# Altium project Mother_Board_SSL2018.PrjPcb
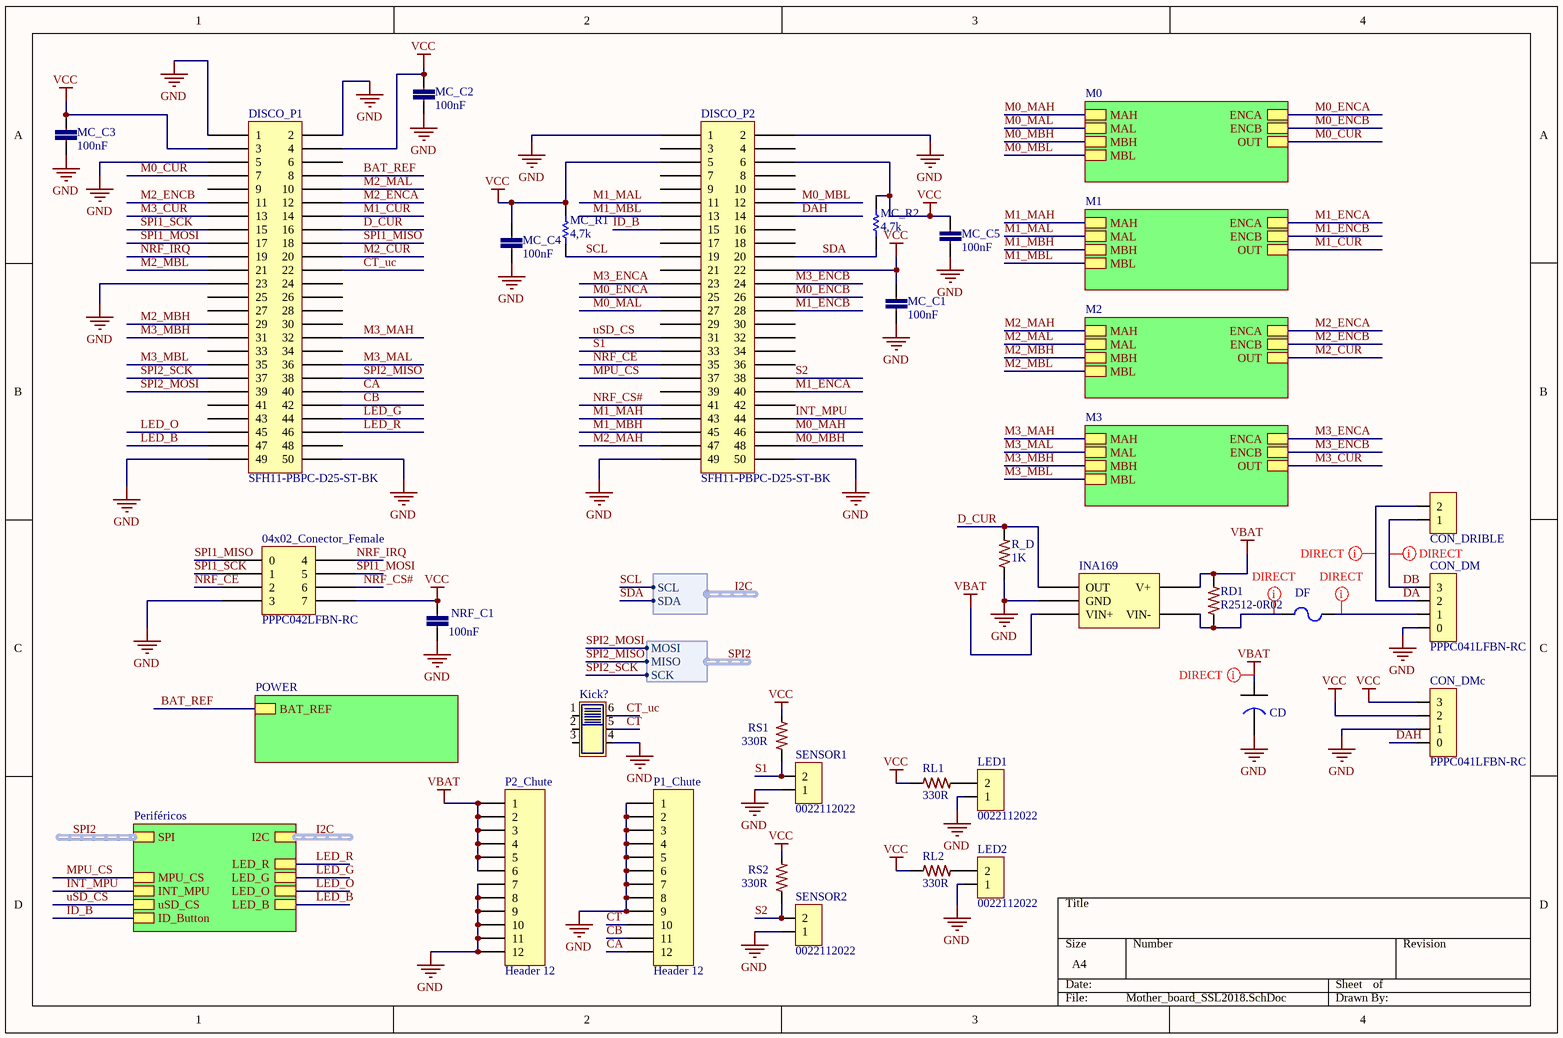
[diagram p0: Mother_board_SSL2018.SchDoc]
2 sheets, 57 parts. Net scope: hierarchical (ports join the sheet entries above them; power ports are global).
Board file: Mother_board_SSL2018.PcbDoc
Sheets:
  Mother_board_SSL2018.SchDoc
    Periféricos = Periféricos.SchDoc

## Sheet Mother_board_SSL2018.SchDoc
size A4

### Parts
04x02_Conector_Female  PPPC042LFBN-RC  [04x02_Conector_Female]
CD  EEE-FK1C681GP  [EEE-FK1C681GP]  (value not drawn)
CON_DM  PPPC041LFBN-RC  [04x01_Conector_Female - duplicate]
CON_DMc  PPPC041LFBN-RC  [04x01_Conector_Female - duplicate]
CON_DRIBLE  0022112022  [02x01_Conector_Male]  (value not drawn)
DF  MF-MSMF250/16X  [RESC4632X16N]  (value not drawn)
DISCO_P1  SFH11-PBPC-D25-ST-BK  [25x02_Conector_Female]
DISCO_P2  SFH11-PBPC-D25-ST-BK  [25x02_Conector_Female]
INA169  INA169NA  [SOT95P280X125-5N]  (value not drawn)
Kick?  JS202011SCQN  [SOP250P750X350-6N]  (value not drawn)
LED1  0022112022  [02x01_Conector_Male]
LED2  0022112022  [02x01_Conector_Male]
MC_C1  100nF  [0402-CAP]
MC_C2  100nF  [0402-CAP]
MC_C3  100nF  [0402-CAP]
MC_C4  100nF  [0402-CAP]
MC_C5  100nF  [0402-CAP]
MC_R1  4,7k  [0402]
MC_R2  4,7k  [0402]
NRF_C1  100nF  [0402-CAP]
P1_Chute  Header 12  [HDR1X12]
P2_Chute  Header 12  [HDR1X12]
R_D  1K  [0402-RES-HD]
RD1  R2512-0R02  [2512-RES-HD]
RL1  330R  [0402-RES-HD]
RL2  330R  [0402-RES-HD]
RS1  330R  [0402-RES-HD]
RS2  330R  [0402-RES-HD]
SENSOR1  0022112022  [02x01_Conector_Male]
SENSOR2  0022112022  [02x01_Conector_Male]

### Sub-sheets
M0 = MOTORES.SchDoc (file not in this document): MBH, MAH, MBL, MAL, ENCA, ENCB, OUT
M1 = MOTORES.SchDoc (file not in this document): MBH, MAH, MBL, MAL, ENCA, ENCB, OUT
M2 = MOTORES.SchDoc (file not in this document): MBH, MAH, MBL, MAL, ENCA, ENCB, OUT
M3 = MOTORES.SchDoc (file not in this document): MBH, MAH, MBL, MAL, ENCA, ENCB, OUT
Periféricos = Periféricos.SchDoc: MPU_CS, INT_MPU, uSD_CS, LED_R, LED_G, LED_O, LED_B, ID_Button, SPI (harness SPI), I2C (harness I2C)
POWER = POWER.SchDoc (file not in this document): BAT_REF

### Harnesses
I2C: SCL, SDA
SPI: MOSI, MISO, SCK

### Nets
GND: 04x02_Conector_Female.3 CD.2 CON_DM.0 CON_DMc.1 DISCO_P1.1 DISCO_P1.2 DISCO_P1.5 DISCO_P1.23 DISCO_P1.49 DISCO_P1.50 DISCO_P2.1 DISCO_P2.2 DISCO_P2.49 DISCO_P2.50 INA169.2(GND) Kick?.4 LED1.1 LED2.1 MC_C1.1 MC_C2.1 MC_C3.2 MC_C4.1 MC_C5.1 NRF_C1.2 P1_Chute.1 P1_Chute.2 P1_Chute.3 P1_Chute.4 P1_Chute.5 P1_Chute.6 P1_Chute.7 P1_Chute.8 P1_Chute.9 P2_Chute.7 P2_Chute.8 P2_Chute.9 P2_Chute.10 P2_Chute.11 P2_Chute.12 R_D.1 SENSOR1.1 SENSOR2.1
VBAT: CD.1 INA169.3(VIN+) INA169.4(V+) P2_Chute.1 P2_Chute.2 P2_Chute.3 P2_Chute.4 P2_Chute.5 P2_Chute.6 RD1.2
VCC: 04x02_Conector_Female.7 CON_DMc.2 CON_DMc.3 DISCO_P1.3 DISCO_P1.4 DISCO_P2.5 DISCO_P2.6 DISCO_P2.22 MC_C1.2 MC_C2.2 MC_C3.1 MC_C4.2 MC_C5.2 MC_R1.2 MC_R2.2 NRF_C1.1 RL1.1 RL2.1 RS1.2 RS2.2
BAT_REF: DISCO_P1.8 ; sheet POWER/BAT_REF
CA: DISCO_P1.40 P1_Chute.12
CB: DISCO_P1.42 P1_Chute.11
CT: Kick?.5 P1_Chute.10
CT_uc: DISCO_P1.22 Kick?.6
D_CUR: DISCO_P1.16 INA169.1(OUT) R_D.2
DA: CON_DM.2 CON_DRIBLE.2
DAH: CON_DMc.0 DISCO_P2.14
DB: CON_DM.3 CON_DRIBLE.1
ID_B: DISCO_P2.15 ; sheet Periféricos/ID_Button
INT_MPU: DISCO_P2.44 ; sheet Periféricos/INT_MPU
LED_B: DISCO_P1.47 ; sheet Periféricos/LED_B  [project net Blue_led]
LED_G: DISCO_P1.44 ; sheet Periféricos/LED_G
LED_O: DISCO_P1.45 ; sheet Periféricos/LED_O
LED_R: DISCO_P1.46 ; sheet Periféricos/LED_R
M0_CUR: DISCO_P1.7 ; sheet M0/OUT
M0_ENCA: DISCO_P2.25 ; sheet M0/ENCA
M0_ENCB: DISCO_P2.26 ; sheet M0/ENCB
M0_MAH: DISCO_P2.46 ; sheet M0/MAH
M0_MAL: DISCO_P2.27 ; sheet M0/MAL
M0_MBH: DISCO_P2.48 ; sheet M0/MBH
M0_MBL: DISCO_P2.12 ; sheet M0/MBL
M1_CUR: DISCO_P1.14 ; sheet M1/OUT
M1_ENCA: DISCO_P2.40 ; sheet M1/ENCA
M1_ENCB: DISCO_P2.28 ; sheet M1/ENCB
M1_MAH: DISCO_P2.43 ; sheet M1/MAH
M1_MAL: DISCO_P2.11 ; sheet M1/MAL
M1_MBH: DISCO_P2.45 ; sheet M1/MBH
M1_MBL: DISCO_P2.13 ; sheet M1/MBL
M2_CUR: DISCO_P1.20 ; sheet M2/OUT
M2_ENCA: DISCO_P1.12 ; sheet M2/ENCA
M2_ENCB: DISCO_P1.11 ; sheet M2/ENCB
M2_MAH: DISCO_P2.47 ; sheet M2/MAH
M2_MAL: DISCO_P1.10 ; sheet M2/MAL
M2_MBH: DISCO_P1.29 ; sheet M2/MBH
M2_MBL: DISCO_P1.21 ; sheet M2/MBL
M3_CUR: DISCO_P1.13 ; sheet M3/OUT
M3_ENCA: DISCO_P2.23 ; sheet M3/ENCA
M3_ENCB: DISCO_P2.24 ; sheet M3/ENCB
M3_MAH: DISCO_P1.32 ; sheet M3/MAH
M3_MAL: DISCO_P1.36 ; sheet M3/MAL
M3_MBH: DISCO_P1.31 ; sheet M3/MBH
M3_MBL: DISCO_P1.35 ; sheet M3/MBL
MPU_CS: DISCO_P2.37 ; sheet Periféricos/MPU_CS
NRF_CE: 04x02_Conector_Female.2 DISCO_P2.35
NRF_CS#: 04x02_Conector_Female.6 DISCO_P2.41
NRF_IRQ: 04x02_Conector_Female.4 DISCO_P1.19
S1: DISCO_P2.33 RS1.1 SENSOR1.2
S2: DISCO_P2.38 RS2.1 SENSOR2.2
SCL: DISCO_P2.19 MC_R1.1 ; sheet Periféricos/I2C.SCL  [project net I2C.SCL]
SDA: DISCO_P2.20 MC_R2.1 ; sheet Periféricos/I2C.SDA  [project net I2C.SDA]
SPI1_MISO: 04x02_Conector_Female.0 DISCO_P1.18
SPI1_MOSI: 04x02_Conector_Female.5 DISCO_P1.17
SPI1_SCK: 04x02_Conector_Female.1 DISCO_P1.15
SPI2_MISO: DISCO_P1.38 ; sheet Periféricos/SPI.MISO  [project net SPI2.MISO]
SPI2_MOSI: DISCO_P1.39 ; sheet Periféricos/SPI.MOSI  [project net SPI2.MOSI]
SPI2_SCK: DISCO_P1.37 ; sheet Periféricos/SPI.SCK  [project net SPI2.SCK]
uSD_CS: DISCO_P2.31 ; sheet Periféricos/uSD_CS
NetCON_DM_1: CON_DM.1 DF.1
NetDF_2: DF.2 INA169.5(VIN-) RD1.1
NetLED1_2: LED1.2 RL1.2
NetLED2_2: LED2.2 RL2.2

Not connected (* = marked no-connect by the designer): DISCO_P1 6 9 24 25 26 27 28 30 33 34 41 43 48; DISCO_P2 3 4 7 8 9 10 16 17 18 21 29 30 32 34 36 39 42; Kick? 1 2 3

### Buses and harness runs
harness I2C = sheet Periféricos/I2C
harness SPI2 = sheet Periféricos/SPI

### Layout directives
net class DIRECT: DA, DB, NetCON_DM_1, NetDF_2, VBAT

### Library data of the parts
04x02_Conector_Female = 04x02_Conector_Female: 8 Position Header Connector 0.100" (2.54mm) Through Hole Gold
CD = CAP AL 680UF/16V: Aluminum Electrolytic Capacitors - SMD Al Lytic Cap SMT FK Series 105C
CON_DM CON_DMc = 04x01_Conector_Female-SCH: 4 Position Header Connector 0.100" (2.54mm) Through Hole Gold
CON_DRIBLE LED1 LED2 SENSOR1 SENSOR2 = 02x01_Conector_Male: CONN HEADER 2POS .100 VERT GOLD
DF = MF-MSMF250/16X-01.A.1: PTC RESETTABLE .30A 30V 1812
DISCO_P1 DISCO_P2 = 25x02_Conector_Female: 50 Position Header Connector 0.100" (2.54mm) Through Hole Gold
INA169 = INA169NA-01.A.1: IC CURRENT MONITOR 0.5% SOT23-5
Kick? = JS202011SCQN-1: SWITCH SLIDE DPDT 300MA 6V; Part No: JS202011SCQN
MC_C1-MC_C5 NRF_C1 = CC0402-100nF-A.12: CAP CER 0.1UF 10V 20% X5R 0402; Part No: VJ0402V104ZXQPBC; Cod EMS: 05.281.006.133; Value: 100n
MC_R1 MC_R2 = Res1: Resistor; Published: 8-Jun-2000; LatestRevisionDate: 17-Jul-2002; LatestRevisionNote: Re-released for DXP Platform.; PackageReference: AXIAL-0.3; Publisher: Altium Limited; PackageDescription: Axial Device, Thru-Hole; 2 Leads; 0.3 in Pin Spacing; Value: 4,7K
P1_Chute P2_Chute = Header 12: Header, 12-Pin; LatestRevisionDate: 17-Jul-2002; LatestRevisionNote: Re-released for DXP Platform.; Publisher: Altium Limited
R_D = R0402-1K-A.9: RES 1K OHM 1/10W 1% 0402 SMD; Part No: ERJ-2RKF1001X; Cod EMS: 05.280.029.527; Family Description: RESISTOR FILME ESPESSO 10R-1M / 1/10W / 1% / 0402. P/N: ERJ-2RKF....X – PANASONIC ELECTRONIC COMPONENTS.; Value: 1K; Family: ERJ-2RKF....X
RD1 = R2512-0R02-4: RES .02 OHM 2W 1% 2512 SMD; Part No: WSL2512R0200FEA18; Cod EMS: 05.280.029.529; Value: 0.02; Family Description: RESISTOR SENTIDO DE CORRENTE 0,010R-0,040R/ 2W / 1% / 2512 P/N: WSL2512.....FEA18 – VISHAY DALE.; Family: WSL2512.....FEA18
RL1 RL2 RS1 RS2 = R0402-330R-7: RES 330 OHM 1/10W 1% 0402 SMD; Part No: ERJ-2RKF3300X; Value: 330; Cod EMS: 05.280.029.506; Family Description: RESISTOR FILME ESPESSO 10R-1M / 1/10W / 1% / 0402. P/N: ERJ-2RKF....X – PANASONIC ELECTRONIC COMPONENTS.; Family: ERJ-2RKF....X

## Sheet Periféricos.SchDoc
size A4
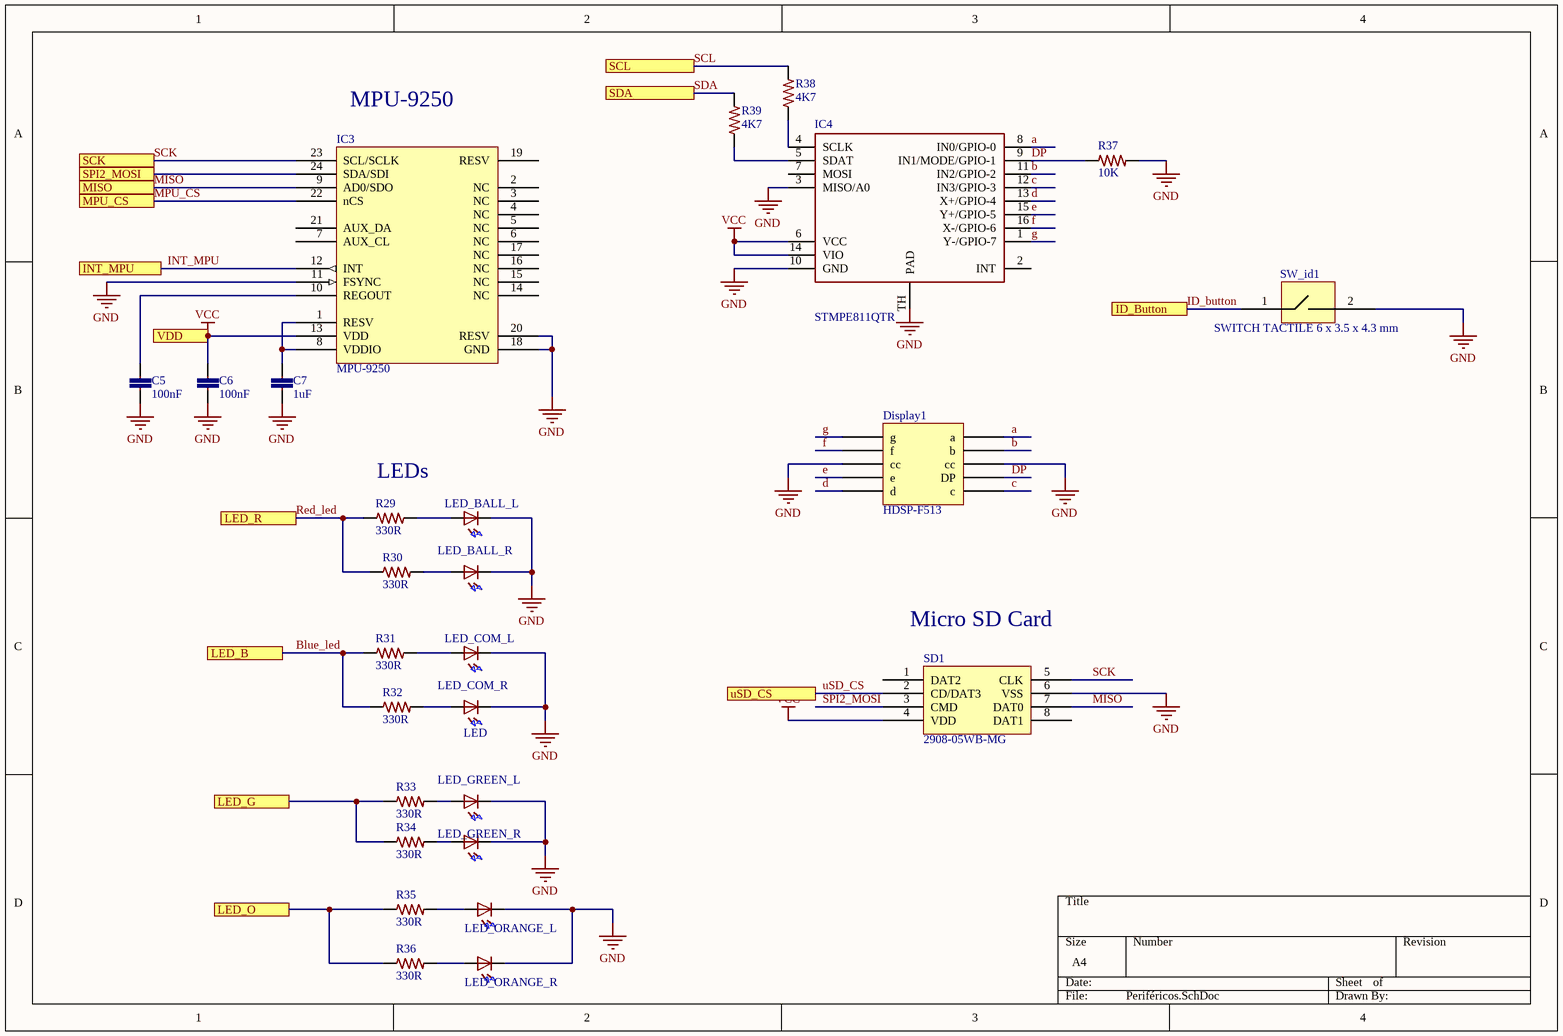
[diagram p1: Periféricos.SchDoc]

### Parts
C5  100nF  [0402-CAP]
C6  100nF  [0402-CAP]
C7  1uF  [0402-CAP]
Display1  HDSP-F513  [New footprint 1]
IC3  MPU-9250  [MPU-9250]
IC4  STMPE811QTR  [QFN16_N]
LED_BALL_L  LED  [LED-5MM-PCB]  (value not drawn)
LED_BALL_R  LED  [LED-5MM-PCB]  (value not drawn)
LED_COM_L  LED  [LED-5MM-PCB]  (value not drawn)
LED_COM_R  LED  [LED-5MM-PCB]
LED_GREEN_L  LED  [LED-5MM-PCB]  (value not drawn)
LED_GREEN_R  LED  [LED-5MM-PCB]  (value not drawn)
LED_ORANGE_L  LED  [LED-5MM-PCB]  (value not drawn)
LED_ORANGE_R  LED  [LED-5MM-PCB]  (value not drawn)
R29  330R  [0402-RES-HD]
R30  330R  [0402-RES-HD]
R31  330R  [0402-RES-HD]
R32  330R  [0402-RES-HD]
R33  330R  [0402-RES-HD]
R34  330R  [0402-RES-HD]
R35  330R  [0402-RES-HD]
R36  330R  [0402-RES-HD]
R37  10K  [0402-RES-HD]
R38  4K7  [0402-RES-HD]
R39  4K7  [0402-RES-HD]
SD1  2908-05WB-MG  [New footprint 1]
SW_id1  SWITCH TACTILE 6 x 3.5 x 4.3 mm  [PCBComponent]

### Ports
ID_Button, INT_MPU, LED_B, LED_G, LED_O, LED_R, MISO, MPU_CS, SCK, SCL, SDA, SPI2_MOSI, uSD_CS, VDD

### Nets
GND: C5.2 C6.2 C7.2 Display1.3(cc) Display1.8(cc) IC3.11(FSYNC) IC3.18(GND) IC3.20(RESV) IC4.3(MISO/A0) IC4.10(GND) IC4.TH(PAD) LED_BALL_L.1(K) LED_BALL_R.1(K) LED_COM_L.1(K) LED_COM_R.1(K) LED_GREEN_L.1(K) LED_GREEN_R.1(K) LED_ORANGE_L.1(K) LED_ORANGE_R.1(K) R37.2 SD1.6(VSS) SW_id1.2
VCC: C6.1 IC3.13(VDD) IC4.6(VCC) IC4.14(VIO) SD1.4(VDD) ; port VDD
a: Display1.6(a) IC4.8(IN0/GPIO-0)
b: Display1.7(b) IC4.11(IN2/GPIO-2)
Blue_led: R31.1 R32.1 ; port LED_B
c: Display1.10(c) IC4.12(IN3/GPIO-3)
d: Display1.5(d) IC4.13(X+/GPIO-4)
DP: Display1.9(DP) IC4.9(IN1/MODE/GPIO-1) R37.1
e: Display1.4(e) IC4.15(Y+/GPIO-5)
f: Display1.2(f) IC4.16(X-/GPIO-6)
g: Display1.1(g) IC4.1(Y-/GPIO-7)
ID_button: SW_id1.1 ; port ID_Button  [project net ID_B]
INT_MPU: IC3.12(INT) ; port INT_MPU
LED_G: R33.1 R34.1 ; port LED_G
LED_O: R35.1 R36.1 ; port LED_O
MISO: IC3.9(AD0/SDO) SD1.7(DAT0) ; port MISO
MPU_CS: IC3.22(nCS) ; port MPU_CS
Red_led: R29.1 R30.1 ; port LED_R  [project net LED_R]
SCK: IC3.23(SCL/SCLK) SD1.5(CLK) ; port SCK
SCL: R38.2 ; port SCL
SDA: R39.2 ; port SDA
SPI2_MOSI: SD1.3(CMD)
uSD_CS: SD1.2(CD/DAT3) ; port uSD_CS
NetC5_1: C5.1 IC3.10(REGOUT)
NetC7_1: C7.1 IC3.1(RESV) IC3.8(VDDIO)
NetIC3_24: IC3.24(SDA/SDI) ; port SPI2_MOSI
NetIC4_4: IC4.4(SCLK) R38.1
NetIC4_5: IC4.5(SDAT) R39.1
NetLED_BALL_L_2: LED_BALL_L.2(A) R29.2
NetLED_BALL_R_2: LED_BALL_R.2(A) R30.2
NetLED_COM_L_2: LED_COM_L.2(A) R31.2
NetLED_COM_R_2: LED_COM_R.2(A) R32.2
NetLED_GREEN_L_2: LED_GREEN_L.2(A) R33.2
NetLED_GREEN_R_2: LED_GREEN_R.2(A) R34.2
NetLED_ORANGE_L_2: LED_ORANGE_L.2(A) R35.2
NetLED_ORANGE_R_2: LED_ORANGE_R.2(A) R36.2

Not connected (* = marked no-connect by the designer): IC3 2(NC) 3(NC) 4(NC) 5(NC) 6(NC) 7(AUX_CL) 14(NC) 15(NC) 16(NC) 17(NC) 19(RESV) 21(AUX_DA); IC4 2(INT) 7(MOSI); SD1 1(DAT2) 8(DAT1)

### Notes on the sheet
- (near IC3) MPU-9250
- (near R29) LEDs
- (near SD1) Micro SD Card

### Library data of the parts
C5 C6 = CC0402-100nF-A.12: as MC_C1 on sheet Mother_board_SSL2018
C7 = CC0402-1uF-5: CAP CER 1UF 6.3V 10% X5R 0402; Part No: JMK105BJ105KV-F; Cod EMS: 05.281.019.513; Value: 1u
Display1 = HDSP-F513-01.A.1: 7 segments display
IC3 = MPU-9250-1: IMU ACCEL/GYRO/MAG I2C/SPI 24QFN; Part No: MPU-9250
IC4 = STMPE811QTR-6: IC TSC I/O EXPAND 8B 16QFN; Cod EMS: 05.284.001.511; Part No: STMPE811QTR
LED_BALL_L LED_BALL_R LED_COM_L LED_COM_R LED_GREEN_L LED_GREEN_R LED_ORANGE_L LED_ORANGE_R = LED-5MM-3: LED 5MM PTH
R29-R36 = R0402-330R-7: RES 330 OHM 1/10W 1% 0402 SMD; Part No: ERJ-2RKF3300X; Cod EMS: 05.280.029.506; Value: 330; Family Description: RESISTOR FILME ESPESSO 10R-1M / 1/10W / 1% / 0402. P/N: ERJ-2RKF....X – PANASONIC ELECTRONIC COMPONENTS.; Family: ERJ-2RKF....X
R37 = R0402-10K-11: RES 10K OHM 1/10W 1% 0402 SMD; Part No: ERJ-2RKF1002X; Cod EMS: 05.280.029.525; Family Description: RESISTOR FILME ESPESSO 10R-1M / 1/10W / 1% / 0402. P/N: ERJ-2RKF....X – PANASONIC ELECTRONIC COMPONENTS.; Value: 10K; Family: ERJ-2RKF....X
R38 R39 = R0402-4K7-6: RES 4.7K OHM 1/10W 1% 0402 SMD; Part No: ERJ-2RKF4701X; Cod EMS: 05.280.029.526; Family Description: RESISTOR FILME ESPESSO 10R-1M / 1/10W / 1% / 0402. P/N: ERJ-2RKF....X – PANASONIC ELECTRONIC COMPONENTS.; Value: 4.7K; Family: ERJ-2RKF....X
SD1 = 2908-05WB-MG-01.A.1: CONN MICRO SD CARD PUSH-PUSH R/A
SW_id1 = 95C04A3GWRT.-1: GRAYHILL TACT,GW,6X3.5,1800T&R,LF Eight, 160g Operating Force, Gull Wing, RoHS Compliant; Part No: 95C04A3GWRT

## Nets that join several sheets
GND: Mother_board_SSL2018 (42 pins), Periféricos (22 pins)
VCC: Mother_board_SSL2018 (20 pins), Periféricos (5 pins)
Blue_led: Mother_board_SSL2018 (DISCO_P1.47), Periféricos (R31.1 R32.1)
ID_B: Mother_board_SSL2018 (DISCO_P2.15), Periféricos (SW_id1.1)
INT_MPU: Mother_board_SSL2018 (DISCO_P2.44), Periféricos (IC3.12)
LED_G: Mother_board_SSL2018 (DISCO_P1.44), Periféricos (R33.1 R34.1)
LED_O: Mother_board_SSL2018 (DISCO_P1.45), Periféricos (R35.1 R36.1)
LED_R: Mother_board_SSL2018 (DISCO_P1.46), Periféricos (R29.1 R30.1)
MPU_CS: Mother_board_SSL2018 (DISCO_P2.37), Periféricos (IC3.22)
uSD_CS: Mother_board_SSL2018 (DISCO_P2.31), Periféricos (SD1.2)